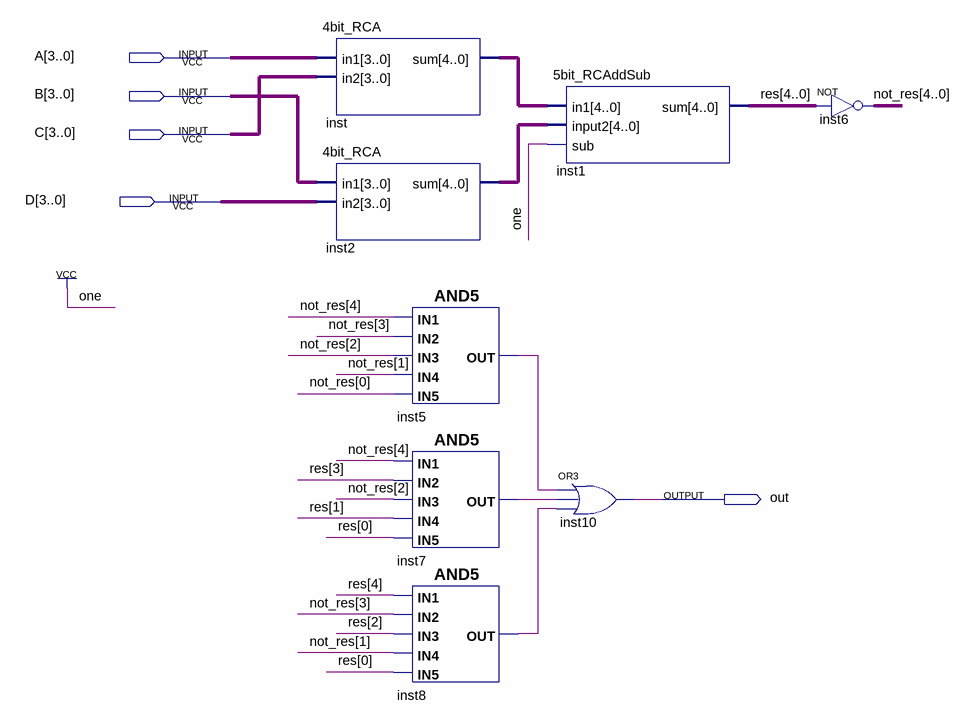
[diagram p0: schematic sheet]
// Quartus schematic P1_mod11.bdf as structural Verilog: 8 symbols, 5 pins
module P1_mod11 (
  input  [3:0] A,
  input  [3:0] B,
  input  [3:0] C,
  input  [3:0] D,
  output out
);

  wire inst5_out, inst7_out, inst8_out;
  wire [4:0] inst2_sum, inst_sum, not_res, res;

  \4bit_RCA  inst (.in1(A), .in2(C), .sum(inst_sum));
  \4bit_RCA  inst2 (.in1(B), .in2(D), .sum(inst2_sum));
  and inst5 (inst5_out, not_res[4], not_res[3], not_res[2], not_res[1], not_res[0]);
  and inst7 (inst7_out, not_res[4], res[3], not_res[2], res[1], res[0]);
  and inst8 (inst8_out, res[4], not_res[3], res[2], not_res[1], res[0]);
  \5bit_RCAddSub  inst1 (.in1(inst_sum), .input2(inst2_sum), .sub(1'b1), .sum(res));
  or inst10 (out, inst5_out, inst7_out, inst8_out);
  assign not_res = ~res;  // NOT inst6, 5 bits wide
endmodule
